# EAGLE design valiant_v3 (EAGLE 7.6.0)
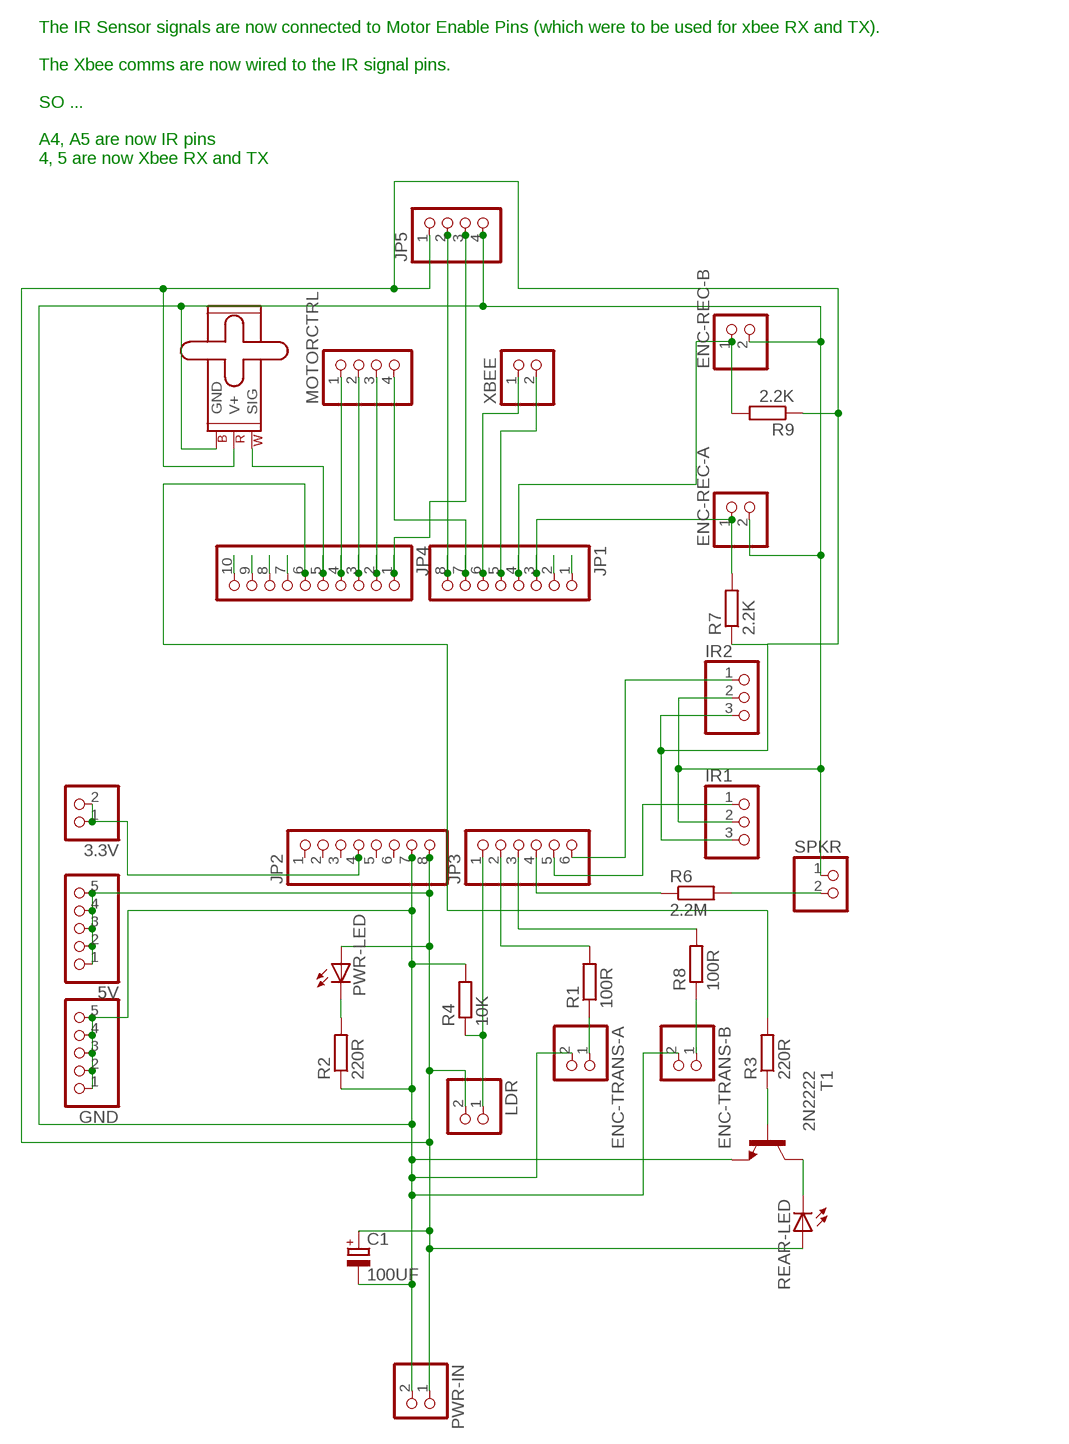
[diagram p0: schematic, sheet 1]

## Parts
3.3V  PINHD-1X2  [1X02]
5V  PINHD-1X5  [1X05]
C1  100UF  CPOL-EUE2,5-6E  [E2,5-6E]
ENC-REC-A  PINHD-1X2  [1X02]
ENC-REC-B  PINHD-1X2  [1X02]
ENC-TRANS-A  PINHD-1X2  [1X02]
ENC-TRANS-B  PINHD-1X2  [1X02]
GND  PINHD-1X5  [1X05]
IR1  PINHD-1X3  [1X03]
IR2  PINHD-1X3  [1X03]
JP1  PINHD-1X8  [1X08]
JP2  PINHD-1X8  [1X08]
JP3  PINHD-1X6  [1X06]
JP4  PINHD-1X10  [1X10]
JP5  PINHD-1X4  [1X04]
LDR  PINHD-1X2  [1X02]
M1  SMALL_SERVO  [1X03]
MOTORCTRL  PINHD-1X4  [1X04]
PWR-IN  PINHD-1X2  [1X02]
PWR-LED  LED5MM  [LED5MM]
R1  100R  R-EU_0204/7  [0204/7]
R2  220R  R-EU_0204/7  [0204/7]
R3  220R  R-EU_0204/7  [0204/7]
R4  10K  R-EU_0204/7  [0204/7]
R6  2.2M  R-EU_0204/7  [0204/7]
R7  2.2K  R-EU_0204/7  [0204/7]
R8  100R  R-EU_0204/7  [0204/7]
R9  2.2K  R-EU_0204/7  [0204/7]
REAR-LED  LED5MM  [LED5MM]
SPKR  PINHD-1X2  [1X02]
T1  2N2222  [TO92-EBC-OVAL]
XBEE  PINHD-1X2  [1X02]

## Nets
N$1: R3.1 T1.B
N$2: JP1.8 JP5.2
N$3: JP1.7 MOTORCTRL.4
N$4: JP4.2 MOTORCTRL.3
N$5: JP4.3 MOTORCTRL.2
N$6: JP4.4 MOTORCTRL.1
N$7: JP4.1 JP5.3
N$8: ENC-TRANS-A.1 R1.1
N$9: JP3.1 LDR.1 R4.1
N$10: JP3.2 R1.2
N$11: JP3.3 R8.2
N$12: JP4.6 R3.2
N$13: ENC-REC-A.1 JP1.3 R7.2
N$14: 3.3V.1 3.3V.2 JP2.4
N$15: 5V.1 5V.2 5V.3 5V.4 5V.5 C1.+ IR1.3 IR2.3 JP2.8 JP5.1 LDR.2 M1.2(V+) PWR-IN.1 PWR-LED.A R7.1 R9.1 REAR-LED.A
N$16: ENC-TRANS-B.1 R8.1
N$17: PWR-LED.K(C) R2.2
N$18: JP4.5 M1.1(SIG)
N$19: REAR-LED.K(C) T1.C
N$20: IR1.1 JP3.5
N$21: JP1.6 XBEE.1
N$22: JP1.5 XBEE.2
N$23: ENC-REC-B.1 JP1.4 R9.2
N$24: R6.2 SPKR.2
N$25: JP3.4 R6.1
N$26: C1.- ENC-REC-A.2 ENC-REC-B.2 ENC-TRANS-A.2 ENC-TRANS-B.2 GND.1 GND.2 GND.3 GND.4 GND.5 IR1.2 IR2.2 JP2.7 JP5.4 M1.3(GND) PWR-IN.2 R2.1 R4.2 SPKR.1 T1.E
N$27: IR2.1 JP3.6
N$28: JP1.1
N$29: JP1.2
N$30: JP4.7
N$31: JP4.8
N$32: JP4.9
N$33: JP4.10
Unconnected: JP2.1 JP2.2 JP2.3 JP2.5 JP2.6

## Notes on the sheet
- The IR Sensor signals are now connected to Motor Enable Pins (which were to be used for xbee RX and TX).
  
  The Xbee comms are now wired to the IR signal pins.
  
  SO ...
  
  A4, A5 are now IR pins
  4, 5 are now Xbee RX and TX

## Library data of the parts
3.3V ENC-REC-A ENC-REC-B ENC-TRANS-A ENC-TRANS-B LDR PWR-IN SPKR XBEE = pinhead:PINHD-1X2: PIN HEADER
5V GND = pinhead:PINHD-1X5: PIN HEADER
C1 = resistor:CPOL-EU: POLARIZED CAPACITOR, European symbol
IR1 IR2 = pinhead:PINHD-1X3: PIN HEADER
JP1 JP2 = pinhead:PINHD-1X8: PIN HEADER
JP3 = pinhead:PINHD-1X6: PIN HEADER
JP4 = pinhead:PINHD-1X10: PIN HEADER
JP5 MOTORCTRL = pinhead:PINHD-1X4: PIN HEADER
M1 = SparkFun-Electromechanical:SMALL_SERVO: Small servo motor This is the small servo used in the SIK. SKU: ROB-09065
PWR-LED REAR-LED = adafruit:LED: LED OSRAM: - CHIPLED LG R971, LG N971, LY N971, LG Q971, LY Q971, LO R971, LY R971 LH N974, LH R974 LS Q976, LO Q976, LY Q976 LO Q996 - Hyper CHIPLED LW Q18S LB Q993, LB Q99A, LB R99A - SideLED LS A670, LO A670, LY A670, LG A670, LP A670 LB A673, LV A673, LT A673, LW A673 LH A674 LY A675 LS A676, LA A676, LO A676, LY A676, LW A676 LS A679, LY A679, LG A679 - Hyper Micro SIDELED® LS Y876, LA Y876, LO Y876, LY Y876 LT Y87S - SmartLED LW L88C, LW L88S LB L89C, LB L89S, LG L890 LS L89K, LO L89K, LY L89K LS L896, LA L896, LO L896, LY L896 - TOPLED LS T670, LO T670, LY T670, LG T670, LP T670 LSG T670, LSP T670, LSY T670, LOP T670, LYG T670 LG T671, LOG T671, LSG T671 LB T673, LV T673, LT T673, LW T673 LH T674 LS T676, LA T676, LO T676, LY T676, LB T676, LH T676, LSB T676, LW T676 LB T67C, LV T67C, LT T67C, LS T67K, LO T67K, LY T67K, LW E67C LS E67B, LA E67B, LO E67B, LY E67B, LB E67C, LV E67C, LT E67C LW T67C LS T679, LY T679, LG T679 LS T770, LO T770, LY T770, LG T770, LP T770 LB T773, LV T773, LT T773, LW T773 LH T774 LS E675, LA E675, LY E675, LS T675 LS T776, LA T776, LO T776, LY T776, LB T776 LHGB T686 LT T68C, LB T68C - Hyper Mini TOPLED® LB M676 - Mini TOPLED Santana® LG M470 LS M47K, LO M47K, LY M47K Source: http://www.osram.convergy.de/
R1-R4 R6-R9 = rcl:R-EU_: RESISTOR, European symbol
T1 = adafruit:2N2222: NPN TRANSISTOR Big oval pads

## Board
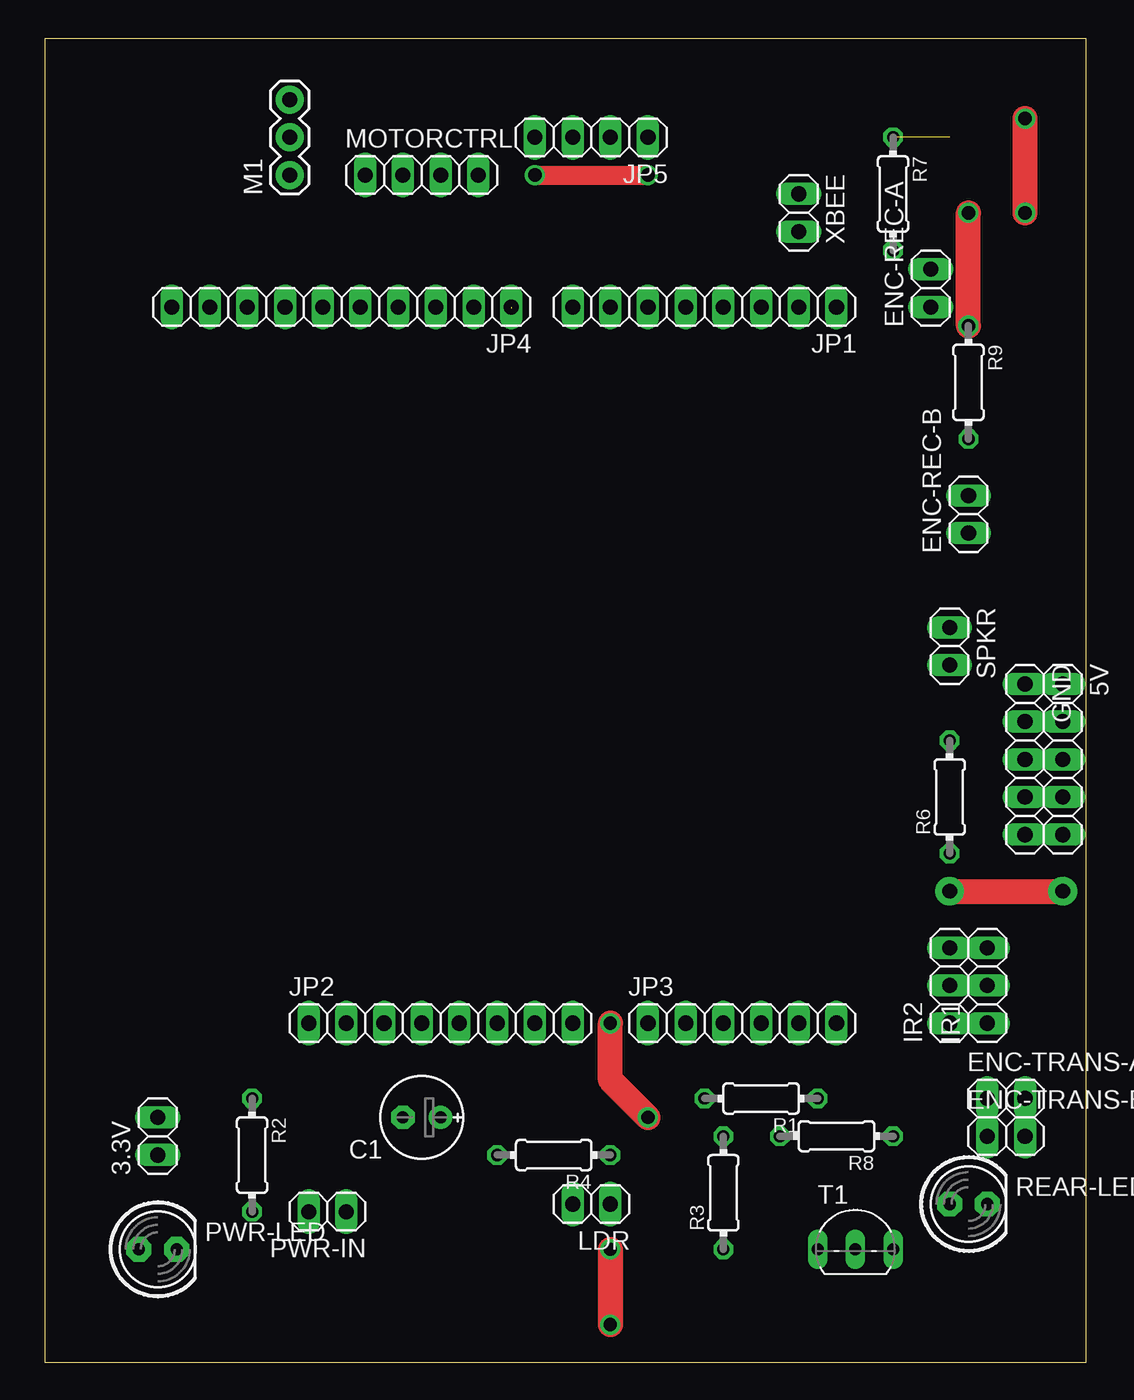
[diagram p1: board, top side]
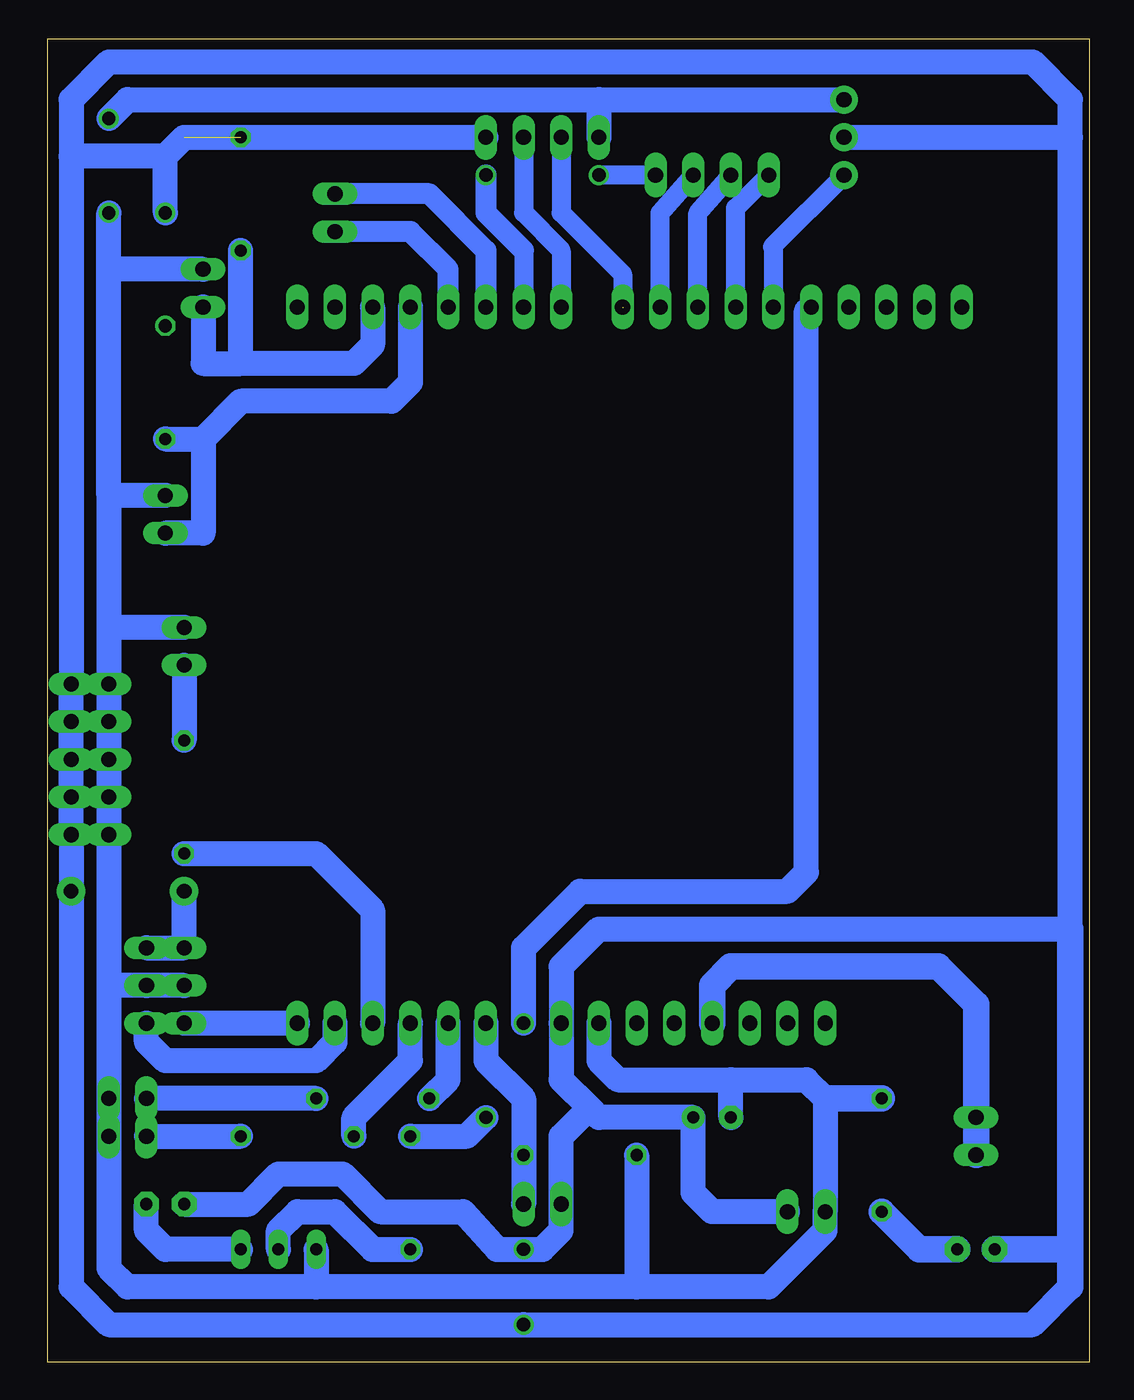
[diagram p2: board, bottom side, seen from below]

Size 70.15 x 89.2 mm. Coordinates in mm from the lower left corner, seen from the top.
Outline: 0,0 70.15,0 70.15,89.2 0,89.2 0,0
Copper layers (1*16): Top 0.035mm / dielectric 1.5mm / Bottom 0.035mm
Design rules "default *": minimum track width 10mil, minimum drill 24mil, track to track 8mil, track to pad 8mil, pad to pad 8mil, via to via 8mil, smd to smd 8mil, copper to edge 40mil, drill to drill 8mil, minimum pad ring 10mil, minimum via ring 8mil, stop-mask expansion 4mil, vias tented up to drill 0mil, thermal gap 10mil

### Footprints (pad centres in the part's own frame; a part is rotated, then mirrored left to right if it is on the bottom)
1X02 = drill 1.016 long: 1 -1.27,0; 2 1.27,0
1X05 = drill 1.016 long: 1 -5.08,0; 2 -2.54,0; 3 0,0; 4 2.54,0; 5 5.08,0
E2,5-6E = drill 0.813 pad 1.575: + -1.27,0 | drill 0.813 pad 1.575 octagon: - 1.27,0
1X03 = drill 1.016 long: 1 -2.54,0; 2 0,0; 3 2.54,0
1X08 = drill 1.016 long: 1 -8.89,0; 2 -6.35,0; 3 -3.81,0; 4 -1.27,0; 5 1.27,0; 6 3.81,0; 7 6.35,0; 8 8.89,0
1X06 = drill 1.016 long: 1 -6.35,0; 2 -3.81,0; 3 -1.27,0; 4 1.27,0; 5 3.81,0; 6 6.35,0
1X10 = drill 1.016 long: 1 -11.43,0; 2 -8.89,0; 3 -6.35,0; 4 -3.81,0; 5 -1.27,0; 6 1.27,0; 7 3.81,0; 8 6.35,0; 9 8.89,0; 10 11.43,0
1X04 = drill 1.016 long: 1 -3.81,0; 2 -1.27,0; 3 1.27,0; 4 3.81,0
1X03' = drill 1.016 pad 1.88: 1 0,0; 2 2.54,0; 3 5.08,0
LED5MM = drill 0.813 pad 1.676 octagon: A -1.27,0; K 1.27,0
0204/7 = drill 0.813 octagon: 1 -3.81,0; 2 3.81,0
TO92-EBC-OVAL = drill 0.813 long: B 0,-1.27; C 2.54,-1.27; E -2.54,-1.27

### Placement (x,y rotation side)
3.3V  7.62,15.24 90 top
5V  68.58,40.64 270 top
C1  25.4,16.51 180 top
ENC-REC-A  59.69,72.39 90 top
ENC-REC-B  62.23,57.15 90 top
ENC-TRANS-A  64.77,17.78 0 top
ENC-TRANS-B  64.77,15.24 0 top
GND  66.04,40.64 270 top
IR1  63.5,25.4 90 top
IR2  60.96,25.4 90 top
JP1  44.45,71.12 180 top
JP2  26.67,22.86 0 top
JP3  46.99,22.86 0 top
JP4  20,71.12 180 top
JP5  36.83,82.55 180 top
LDR  36.83,10.67 180 top
M1  SMALL_SERVO  [1X03']  16.51,80.01 90 top
MOTORCTRL  25.4,80.01 0 top
PWR-IN  19.05,10.16 180 top
PWR-LED  7.62,7.62 0 top
R1  48.26,17.78 180 top
R2  13.97,13.97 270 top
R3  45.72,11.43 90 top
R4  34.29,13.97 180 top
R6  60.96,38.1 90 top
R7  57.15,78.74 270 top
R8  53.34,15.24 180 top
R9  62.23,66.04 270 top
REAR-LED  62.23,10.67 0 top
SPKR  60.96,48.26 270 top
T1  54.61,8.89 0 top
XBEE  50.8,77.47 270 top

### Tracks (layer width: path | path; a pad name or v marks a point on that pad's centre or on a via)
N$1
  Bottom 1.676: T1.B 54.61,8.89 53.34,10.16 50.8,10.16 48.26,7.62 R3.1
N$2
  Bottom 1.27: JP5.2 38.1,77.47 35.56,74.93 JP1.8
N$3  (via drill 0.9)
  Top 1.27: v33.02,80.01 v40.64,80.01
  Bottom 1.27: MOTORCTRL.4 v33.02,80.01 | 38.1,74.93 JP1.7
  Bottom 1.422: v40.64,80.01 40.64,77.47 38.1,74.93
N$4
  Bottom 1.27: JP4.2 28.89,77.47 MOTORCTRL.3
N$5
  Bottom 1.27: JP4.3 26.35,77.47 MOTORCTRL.2
N$6
  Bottom 1.27: JP4.4 23.81,77.79 MOTORCTRL.1
N$7  (1 unrouted)
  Bottom 1.27: JP5.3 35.56,77.47 31.43,73.34 31.43,71.06
N$8
  Bottom 1.676: R1.1 ENC-TRANS-A.1
N$9
  Bottom 1.676: LDR.1 R4.1 38.1,17.78 40.64,20.32 JP3.1
N$10
  Bottom 1.676: R1.2 43.18,19.05 JP3.2
N$11
  Bottom 1.676: R8.2 49.53,16.51 45.72,20.32 JP3.3
N$12  (via drill 0.9)
  Top 1.676: v40.64,16.51 38.1,19.05 v38.1,22.86
  Bottom 0.406: JP4.6 19.05,71.12 19.05,70.87
  Bottom 1.422: 18.73,70.8 JP4.6
  Bottom 1.676: R3.2 41.91,15.24 v40.64,16.51 | v38.1,22.86 38.1,27.94 34.29,31.75 20.32,31.75 19.05,33.02 19.05,70.87
N$13
  Bottom 1.676: JP1.3 48.26,68.58 49.53,67.31 57.15,67.31 | ENC-REC-A.1 59.69,67.31 57.15,67.31 | 57.15,67.31 R7.2
N$14
  Bottom 1.778: JP2.4 25.4,25.4 24.13,26.67 10.16,26.67 7.62,24.13 3.3V.2 3.3V.1
N$15  (via drill 0.9, 1 pad 1.93)  (1 unrouted)
  Top 1.676: R9.1 v62.23,77.47 | v38.1,7.62 v38.1,2.54 | v60.96,31.75 v68.58,31.75
  Bottom 1.676: 1.27,5.08 3.81,2.54 v38.1,2.54 66.04,2.54 68.58,5.08 v68.58,31.75 5V.5 5V.4 5V.3 5V.2 5V.1 68.58,81.28 | v62.23,77.47 62.23,81.28 | 33.66,17.14 35.56,19.05 JP2.8 35.56,26.67 33.02,29.21 1.27,29.21 1.27,82.55 | 33.66,17.14 33.02,16.51 C1.+ 26.67,11.43 25.4,10.16 PWR-IN.1 | 33.66,17.14 35.56,15.24 LDR.2 35.56,8.89 36.83,7.62 v38.1,7.62 39.88,7.62 42.16,10.16 47.75,10.16 50.29,12.7 54.61,12.7 56.64,10.67 REAR-LED.A | 62.23,81.28 68.58,81.28 | 1.27,82.55 1.27,85.09 3.81,87.63 66.04,87.63 68.58,85.09 68.58,81.28 | M1.2 1.27,82.55 | 62.23,81.28 60.96,82.55 JP5.1 | IR1.3 IR2.3 v60.96,31.75
  Bottom 1.778: 1.27,29.21 1.27,7.62 | 1.27,5.08 1.27,7.62 | 1.27,7.62 PWR-LED.A
  other vias: 62.23,69.85
N$16
  Bottom 1.676: ENC-TRANS-B.1 R8.1
N$17
  Bottom 1.778: R2.2 11.43,7.62 PWR-LED.K
N$18
  Bottom 1.27: M1.1 21.34,75.18 21.27,75.18 JP4.5
N$19
  Bottom 1.676: T1.C 62.23,7.62 63.5,8.89 REAR-LED.K
N$20
  Bottom 1.676: JP3.5 50.8,21.59 52.07,20.32 62.23,20.32 63.5,21.59 IR1.1
N$21
  Bottom 1.422: JP1.6 40.64,74.93 44.45,78.74 XBEE.1
N$22
  Bottom 1.422: JP1.5 43.18,73.66 45.72,76.2 XBEE.2
N$23
  Bottom 1.676: JP1.4 45.72,66.04 46.99,64.77 57.15,64.77 59.69,62.23 | ENC-REC-B.1 59.69,55.88 59.69,62.23 | R9.2 59.69,62.23
N$24
  Bottom 1.676: SPKR.2 R6.2
N$25
  Bottom 1.676: R6.1 52.07,34.29 48.26,30.48 JP3.4
N$26  (via drill 0.9)
  Top 1.676: v66.04,77.47 v66.04,83.82
  Bottom 1.676: 33.02,85.09 JP5.4 | 66.04,25.4 GND.5 GND.4 GND.3 GND.2 GND.1 66.04,49.53 | 66.04,25.4 ENC-TRANS-A.2 ENC-TRANS-B.2 66.04,6.35 64.77,5.08 52.07,5.08 | 66.04,73.66 v66.04,77.47 | 30.48,5.08 21.59,5.08 17.78,8.89 PWR-IN.2 17.78,17.78 19.05,19.05 24.13,19.05 | 30.48,5.08 52.07,5.08 | JP2.7 33.02,20.32 31.75,19.05 24.13,19.05 | 33.02,85.09 M1.3 | ENC-REC-A.2 66.04,73.66 | R4.2 30.48,5.08 | C1.- 24.13,19.05 | v66.04,83.82 64.77,85.09 33.02,85.09 | T1.E 52.07,5.08 | ENC-REC-B.2 66.04,58.42 | 66.04,58.42 66.04,49.53 | 66.04,58.42 66.04,73.66 | IR2.2 IR1.2 66.04,25.4 | SPKR.1 66.04,49.53
  Bottom 1.778: 17.78,17.78 R2.1
N$27
  Bottom 1.676: JP3.6 IR2.1